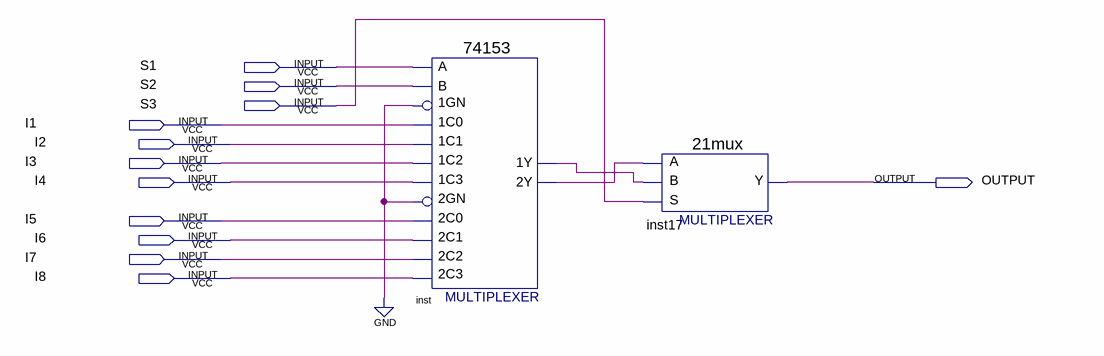
[diagram p0: schematic sheet]
// Quartus schematic 81MUXPZ.bdf as structural Verilog: 2 symbols, 12 pins
module \81MUXPZ  (
  input  S1,
  input  S2,
  input  S3,
  input  I1,
  input  I2,
  input  I3,
  input  I4,
  input  I5,
  input  I6,
  input  I7,
  input  I8,
  output OUTPUT
);

  wire inst_1y, inst_2y;

  \74153  inst (
    .\1C1 (I2), .\1GN (1'b0), .\1C0 (I1), .\2C0 (I5), .\2GN (1'b0), .\2C2 (I7), .\1C2 (I3), .\1C3 (I4),
    .B(S2), .A(S1), .\2C1 (I6), .\2C3 (I8), .\1Y (inst_1y), .\2Y (inst_2y));
  \21mux  inst17 (.S(S3), .B(inst_1y), .A(inst_2y), .Y(OUTPUT));
endmodule
